# EAGLE design YF-Buzzer (EAGLE 9.5.2)
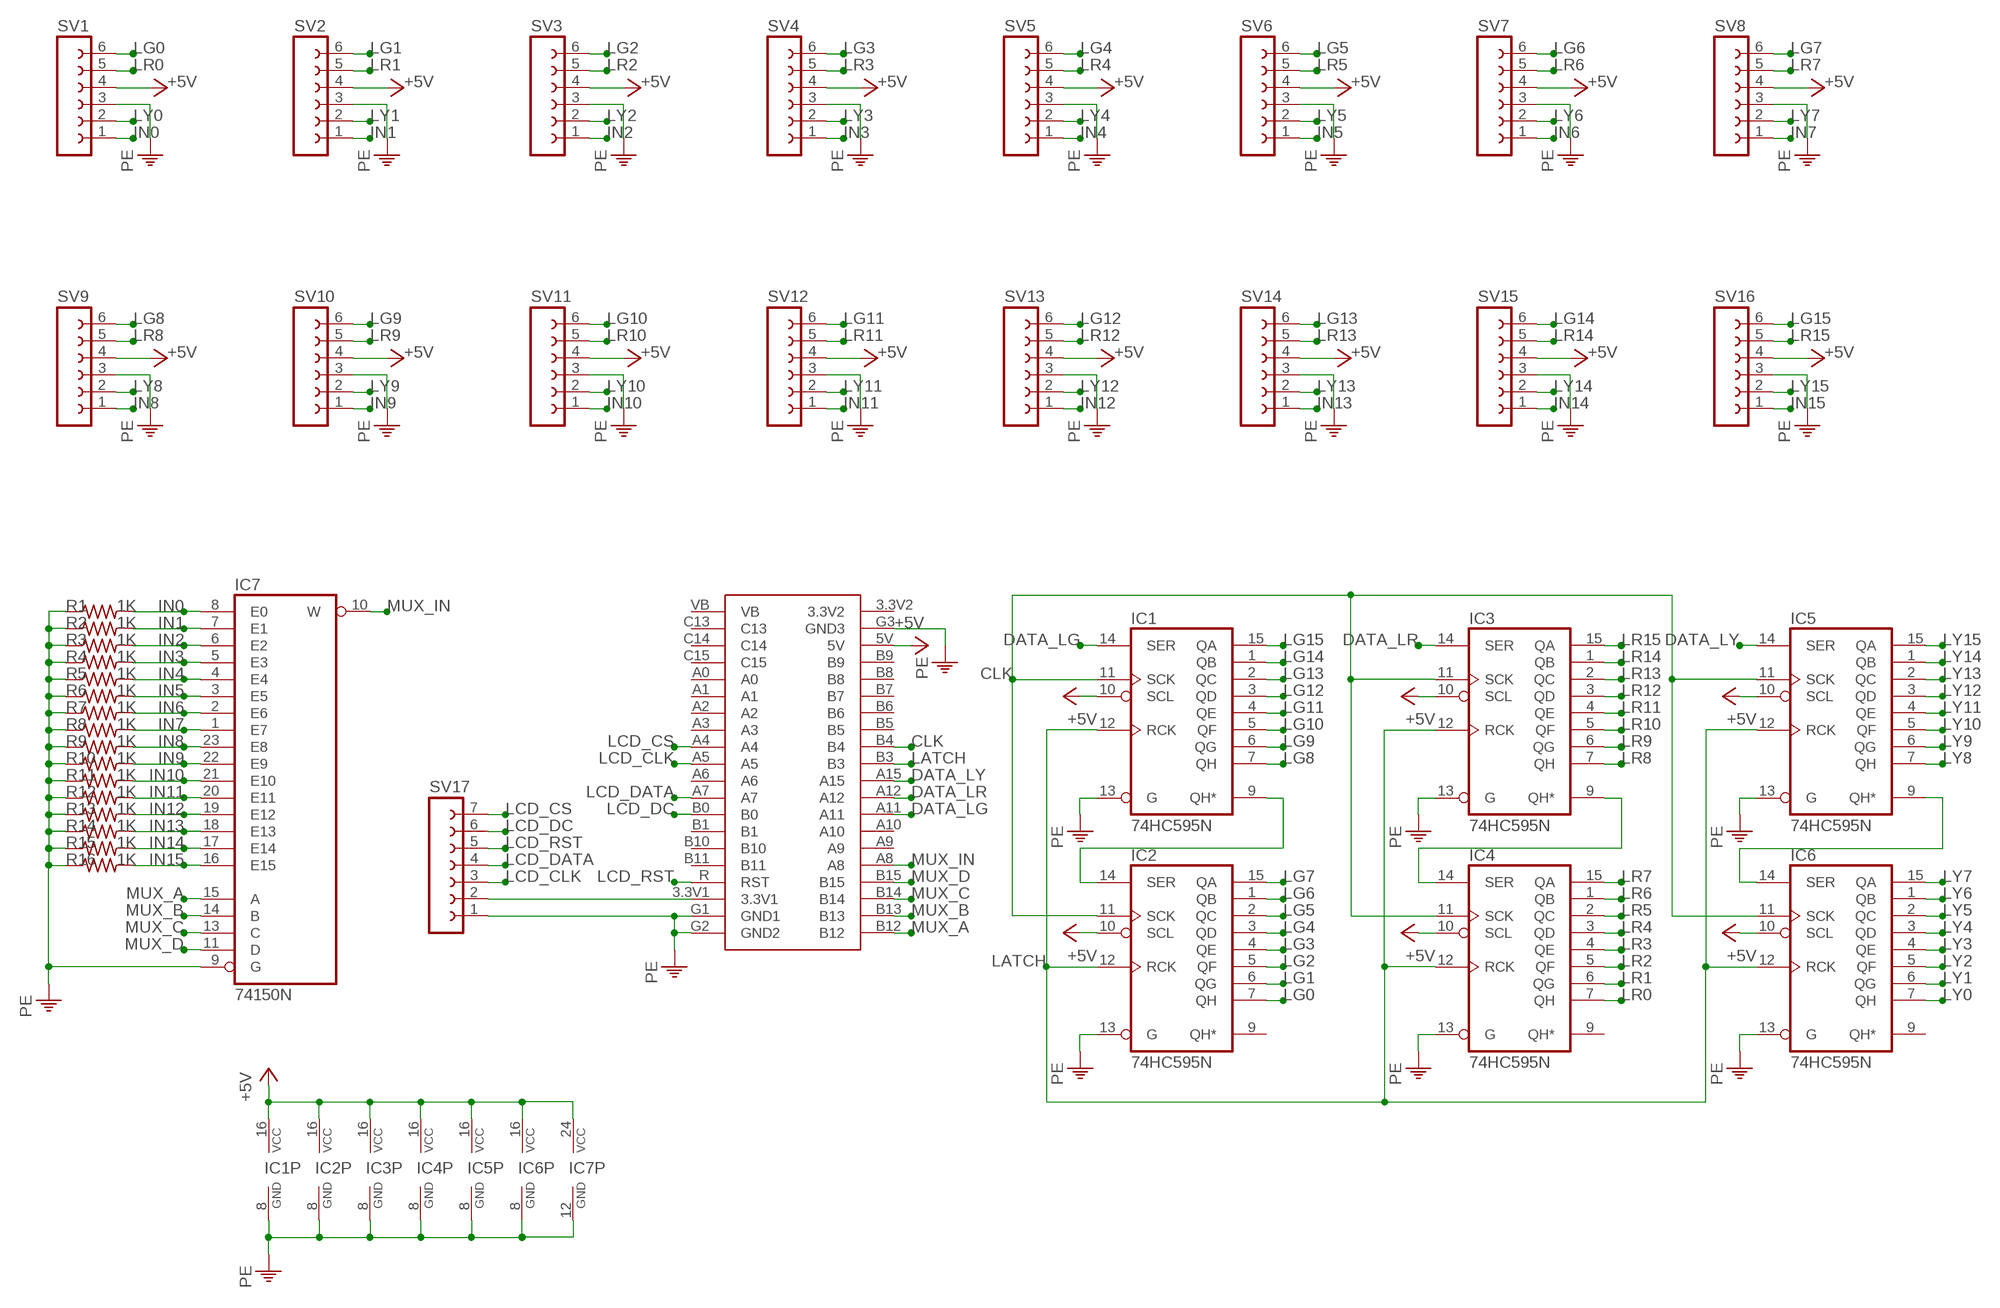
[diagram p0: schematic, sheet 1]

## Parts
IC1  74HC595N  [DIL16]
IC2  74HC595N  [DIL16]
IC3  74HC595N  [DIL16]
IC4  74HC595N  [DIL16]
IC5  74HC595N  [DIL16]
IC6  74HC595N  [DIL16]
IC7  74150N  [DIL24-6]
MCU1  STM32-BLUE  [STM32-BLUE]
R1  1K  R-US_0207/10  [0207/10]
R2  1K  R-US_0207/10  [0207/10]
R3  1K  R-US_0207/10  [0207/10]
R4  1K  R-US_0207/10  [0207/10]
R5  1K  R-US_0207/10  [0207/10]
R6  1K  R-US_0207/10  [0207/10]
R7  1K  R-US_0207/10  [0207/10]
R8  1K  R-US_0207/10  [0207/10]
R9  1K  R-US_0207/10  [0207/10]
R10  1K  R-US_0207/10  [0207/10]
R11  1K  R-US_0207/10  [0207/10]
R12  1K  R-US_0207/10  [0207/10]
R13  1K  R-US_0207/10  [0207/10]
R14  1K  R-US_0207/10  [0207/10]
R15  1K  R-US_0207/10  [0207/10]
R16  1K  R-US_0207/10  [0207/10]
SV1  FE06-1  [FE06]
SV2  FE06-1  [FE06]
SV3  FE06-1  [FE06]
SV4  FE06-1  [FE06]
SV5  FE06-1  [FE06]
SV6  FE06-1  [FE06]
SV7  FE06-1  [FE06]
SV8  FE06-1  [FE06]
SV9  FE06-1  [FE06]
SV10  FE06-1  [FE06]
SV11  FE06-1  [FE06]
SV12  FE06-1  [FE06]
SV13  FE06-1  [FE06]
SV14  FE06-1  [FE06]
SV15  FE06-1  [FE06]
SV16  FE06-1  [FE06]
SV17  FE07-1  [FE07]

## Nets
+5V: IC1.10(SCL) IC1.16(VCC) IC2.10(SCL) IC2.16(VCC) IC3.10(SCL) IC3.16(VCC) IC4.10(SCL) IC4.16(VCC) IC5.10(SCL) IC5.16(VCC) IC6.10(SCL) IC6.16(VCC) IC7.24(VCC) MCU1.5V SV1.4 SV2.4 SV3.4 SV4.4 SV5.4 SV6.4 SV7.4 SV8.4 SV9.4 SV10.4 SV11.4 SV12.4 SV13.4 SV14.4 SV15.4 SV16.4
CLK: IC1.11(SCK) IC2.11(SCK) IC3.11(SCK) IC4.11(SCK) IC5.11(SCK) IC6.11(SCK) MCU1.B4
DATA_LG: IC1.14(SER) MCU1.A11
DATA_LR: IC3.14(SER) MCU1.A12
DATA_LY: IC5.14(SER) MCU1.A15
IN0: IC7.8(E0) R1.2 SV1.1
IN1: IC7.7(E1) R2.2 SV2.1
IN2: IC7.6(E2) R3.2 SV3.1
IN3: IC7.5(E3) R4.2 SV4.1
IN4: IC7.4(E4) R5.2 SV5.1
IN5: IC7.3(E5) R6.2 SV6.1
IN6: IC7.2(E6) R7.2 SV7.1
IN7: IC7.1(E7) R8.2 SV8.1
IN8: IC7.23(E8) R9.2 SV9.1
IN9: IC7.22(E9) R10.2 SV10.1
IN10: IC7.21(E10) R11.2 SV11.1
IN11: IC7.20(E11) R12.2 SV12.1
IN12: IC7.19(E12) R13.2 SV13.1
IN13: IC7.18(E13) R14.2 SV14.1
IN14: IC7.17(E14) R15.2 SV15.1
IN15: IC7.16(E15) R16.2 SV16.1
LATCH: IC1.12(RCK) IC2.12(RCK) IC3.12(RCK) IC4.12(RCK) IC5.12(RCK) IC6.12(RCK) MCU1.B3
LCD_CLK: MCU1.A5 SV17.3
LCD_CS: MCU1.A4 SV17.7
LCD_DATA: MCU1.A7 SV17.4
LCD_DC: MCU1.B0 SV17.6
LCD_RST: MCU1.R(RST) SV17.5
LG0: IC2.7(QH) SV1.6
LG1: IC2.6(QG) SV2.6
LG2: IC2.5(QF) SV3.6
LG3: IC2.4(QE) SV4.6
LG4: IC2.3(QD) SV5.6
LG5: IC2.2(QC) SV6.6
LG6: IC2.1(QB) SV7.6
LG7: IC2.15(QA) SV8.6
LG8: IC1.7(QH) SV9.6
LG9: IC1.6(QG) SV10.6
LG10: IC1.5(QF) SV11.6
LG11: IC1.4(QE) SV12.6
LG12: IC1.3(QD) SV13.6
LG13: IC1.2(QC) SV14.6
LG14: IC1.1(QB) SV15.6
LG15: IC1.15(QA) SV16.6
LR0: IC4.7(QH) SV1.5
LR1: IC4.6(QG) SV2.5
LR2: IC4.5(QF) SV3.5
LR3: IC4.4(QE) SV4.5
LR4: IC4.3(QD) SV5.5
LR5: IC4.2(QC) SV6.5
LR6: IC4.1(QB) SV7.5
LR7: IC4.15(QA) SV8.5
LR8: IC3.7(QH) SV9.5
LR9: IC3.6(QG) SV10.5
LR10: IC3.5(QF) SV11.5
LR11: IC3.4(QE) SV12.5
LR12: IC3.3(QD) SV13.5
LR13: IC3.2(QC) SV14.5
LR14: IC3.1(QB) SV15.5
LR15: IC3.15(QA) SV16.5
LY0: IC6.7(QH) SV1.2
LY1: IC6.6(QG) SV2.2
LY2: IC6.5(QF) SV3.2
LY3: IC6.4(QE) SV4.2
LY4: IC6.3(QD) SV5.2
LY5: IC6.2(QC) SV6.2
LY6: IC6.1(QB) SV7.2
LY7: IC6.15(QA) SV8.2
LY8: IC5.7(QH) SV9.2
LY9: IC5.6(QG) SV10.2
LY10: IC5.5(QF) SV11.2
LY11: IC5.4(QE) SV12.2
LY12: IC5.3(QD) SV13.2
LY13: IC5.2(QC) SV14.2
LY14: IC5.1(QB) SV15.2
LY15: IC5.15(QA) SV16.2
MUX_A: IC7.15(A) MCU1.B12
MUX_B: IC7.14(B) MCU1.B13
MUX_C: IC7.13(C) MCU1.B14
MUX_D: IC7.11(D) MCU1.B15
MUX_IN: IC7.10(W) MCU1.A8
N$1: IC1.9(QH*) IC2.14(SER)
N$2: IC3.9(QH*) IC4.14(SER)
N$3: IC5.9(QH*) IC6.14(SER)
N$36: MCU1.3.3V1 SV17.2
PE: IC1.8(GND) IC1.13(G) IC2.8(GND) IC2.13(G) IC3.8(GND) IC3.13(G) IC4.8(GND) IC4.13(G) IC5.8(GND) IC5.13(G) IC6.8(GND) IC6.13(G) IC7.9(G) IC7.12(GND) MCU1.G1(GND1) MCU1.G2(GND2) MCU1.G3(GND3) R1.1 R2.1 R3.1 R4.1 R5.1 R6.1 R7.1 R8.1 R9.1 R10.1 R11.1 R12.1 R13.1 R14.1 R15.1 R16.1 SV1.3 SV2.3 SV3.3 SV4.3 SV5.3 SV6.3 SV7.3 SV8.3 SV9.3 SV10.3 SV11.3 SV12.3 SV13.3 SV14.3 SV15.3 SV16.3 SV17.1
Unconnected: IC2.9(QH*) IC4.9(QH*) IC6.9(QH*) MCU1.A0 MCU1.A1 MCU1.A2 MCU1.A3 MCU1.A6 MCU1.A9 MCU1.A10 MCU1.B1 MCU1.B5 MCU1.B6 MCU1.B7 MCU1.B8 MCU1.B9 MCU1.B10 MCU1.B11 MCU1.C13 MCU1.C14 MCU1.C15

## Power pins joined to a net without a drawn wire
3.3V2: MCU1.3.3V2
VB: MCU1.VB

## Library data of the parts
IC1-IC6 = 74xx-eu:74*595: 8-bit SHIFT REGISTER, output latch
IC7 = 74xx-eu:74*150: Data SELCTOR/MULTIPLEXER
MCU1 = Jonathan:STM32-BLUE: STM32 Blue Pill <https://wiki.stm32duino.com/index.php?title=Blue_Pill> Designed for the STM32F103 microcontroller board. V1.0 by Jonathan Ho May 2019
R1-R16 = rcl:R-US_: RESISTOR, American symbol; SPICEPREFIX: R
SV1-SV16 = con-lsta:FE06-1: FEMALE HEADER; OC_FARNELL: unknown; OC_NEWARK: unknown
SV17 = con-lsta:FE07-1: FEMALE HEADER; OC_FARNELL: unknown; OC_NEWARK: unknown

## Board
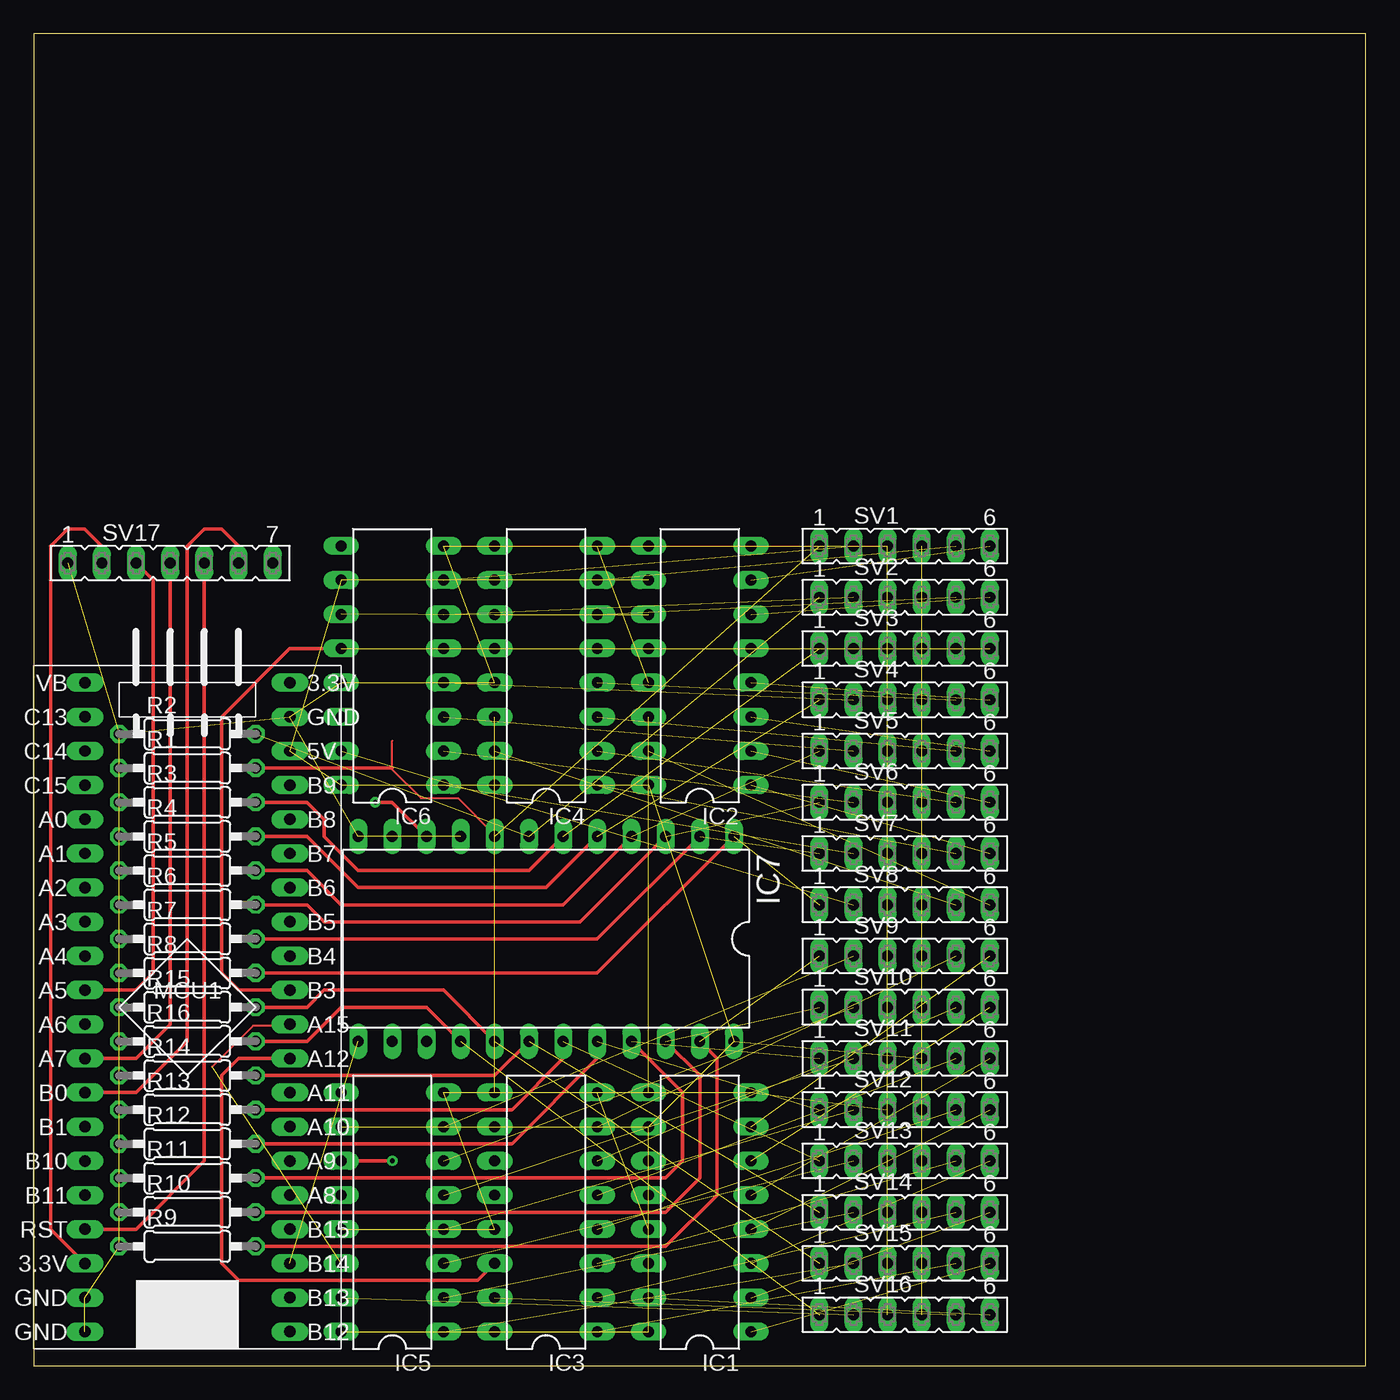
[diagram p1: board, top side]
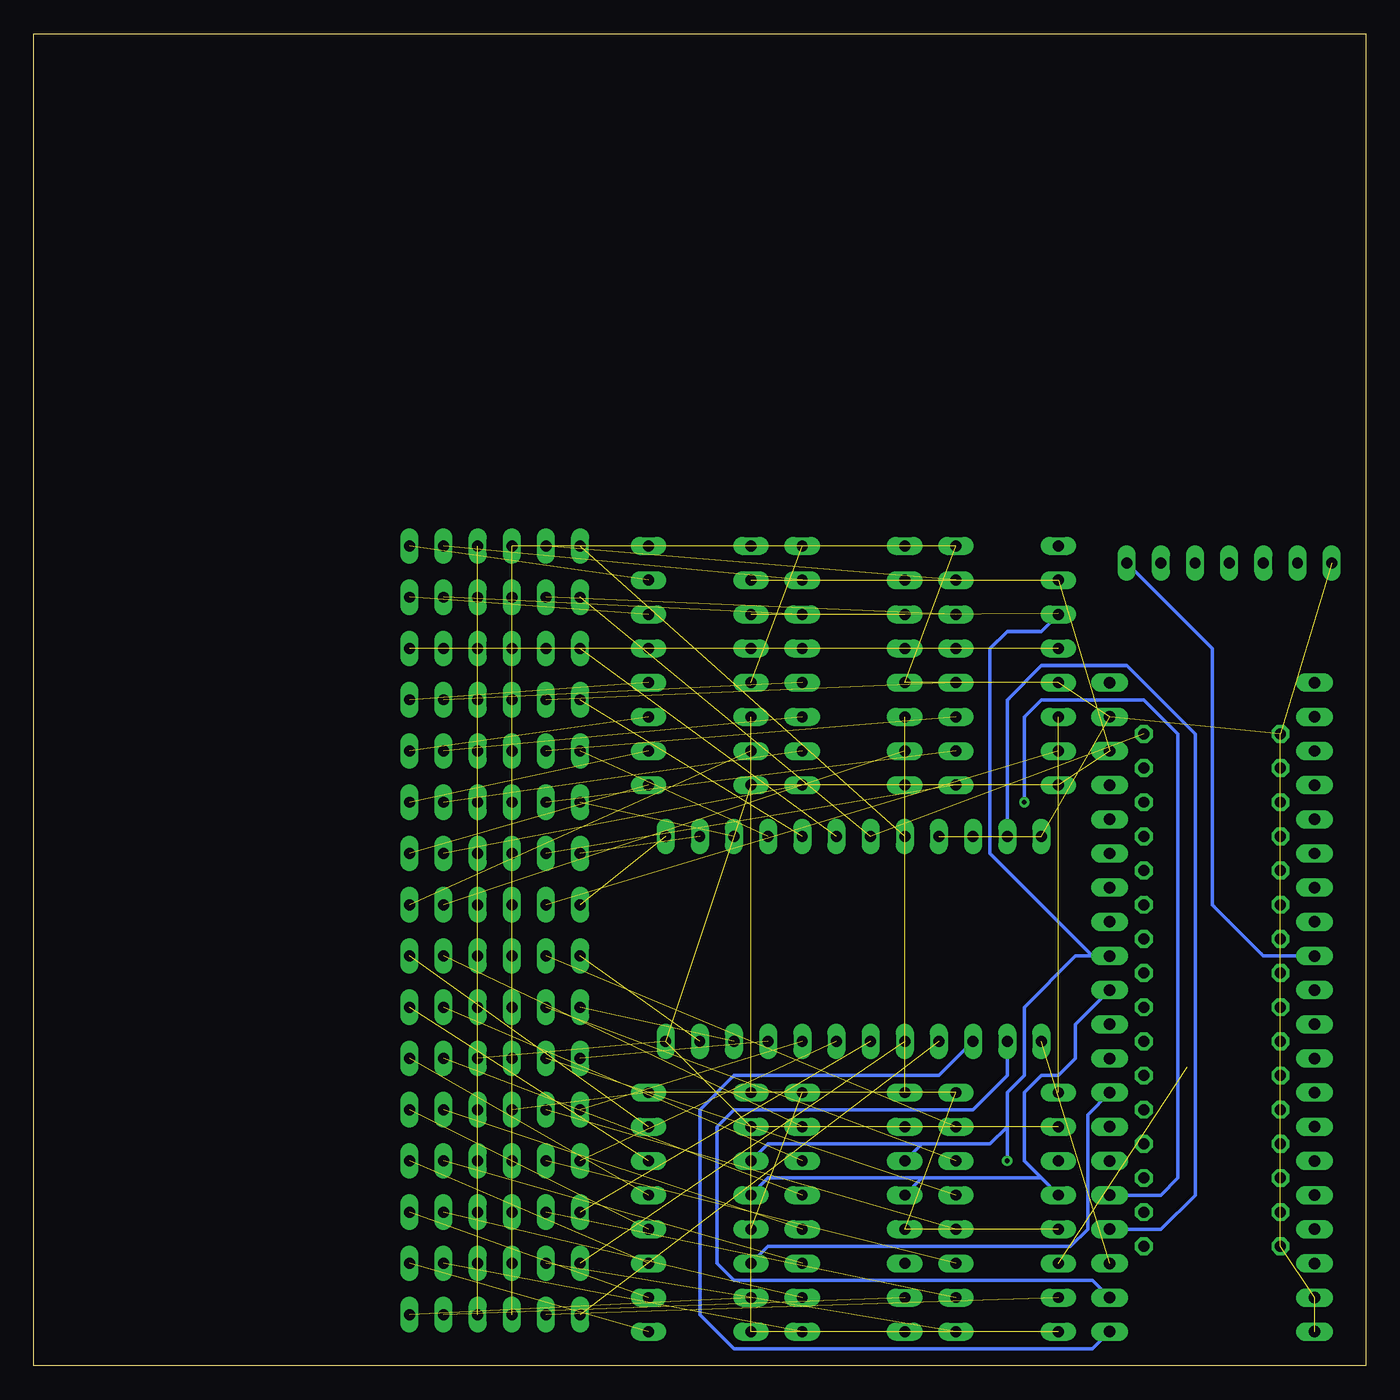
[diagram p2: board, bottom side, seen from below]

Size 99.06 x 99.06 mm. Coordinates in mm from the lower left corner, seen from the top.
Outline: 0,0 99.06,0 99.06,99.06 0,99.06 0,0
Copper layers (1*16): Top 0.035mm / dielectric 1.5mm / Bottom 0.035mm
Design rules "default": minimum track width 6mil, minimum drill 0.35mm, track to track 6mil, track to pad 6mil, pad to pad 6mil, via to via 6mil, smd to smd 6mil, copper to edge 40mil, drill to drill 6mil, minimum pad ring 10mil, minimum via ring 8mil, stop-mask expansion 4mil, vias tented up to drill 0mil, thermal gap 10mil

### Footprints (pad centres in the part's own frame; a part is rotated, then mirrored left to right if it is on the bottom)
DIL16 = drill 0.813 long: 1 -8.89,-3.81; 2 -6.35,-3.81; 3 -3.81,-3.81; 4 -1.27,-3.81; 5 1.27,-3.81; 6 3.81,-3.81; 7 6.35,-3.81; 8 8.89,-3.81; 9 8.89,3.81; 10 6.35,3.81; 11 3.81,3.81; 12 1.27,3.81; 13 -1.27,3.81; 14 -3.81,3.81; 15 -6.35,3.81; 16 -8.89,3.81
DIL24-6 = drill 0.813 long: 1 -13.97,-7.62; 2 -11.43,-7.62; 3 -8.89,-7.62; 4 -6.35,-7.62; 5 -3.81,-7.62; 6 -1.27,-7.62; 7 1.27,-7.62; 8 3.81,-7.62; 9 6.35,-7.62; 10 8.89,-7.62; 11 11.43,-7.62; 12 13.97,-7.62; 13 13.97,7.62; 14 11.43,7.62; 15 8.89,7.62; 16 6.35,7.62; 17 3.81,7.62; 18 1.27,7.62; 19 -1.27,7.62; 20 -3.81,7.62; 21 -6.35,7.62; 22 -8.89,7.62; 23 -11.43,7.62; 24 -13.97,7.62
STM32-BLUE = drill 0.85 long: 3.3V1 -7.62,-19.05; 3.3V2 7.62,24.13; 5V 7.62,19.05; A0 -7.62,13.97; A1 -7.62,11.43; A2 -7.62,8.89; A3 -7.62,6.35; A4 -7.62,3.81; A5 -7.62,1.27; A6 -7.62,-1.27; A7 -7.62,-3.81; A8 7.62,-13.97; A9 7.62,-11.43; A10 7.62,-8.89; A11 7.62,-6.35; A12 7.62,-3.81; A15 7.62,-1.27; B0 -7.62,-6.35; B1 -7.62,-8.89; B3 7.62,1.27; B4 7.62,3.81; B5 7.62,6.35; B6 7.62,8.89; B7 7.62,11.43; B8 7.62,13.97; B9 7.62,16.51; B10 -7.62,-11.43; B11 -7.62,-13.97; B12 7.62,-24.13; B13 7.62,-21.59; B14 7.62,-19.05; B15 7.62,-16.51; C13 -7.62,21.59; C14 -7.62,19.05; C15 -7.62,16.51; G1 -7.62,-21.59; G2 -7.62,-24.13; G3 7.62,21.59; R -7.62,-16.51; VB -7.62,24.13
0207/10 = drill 0.813 octagon: 1 -5.08,0; 2 5.08,0
FE06 = drill 0.813 long: 1 -6.35,0; 2 -3.81,0; 3 -1.27,0; 4 1.27,0; 5 3.81,0; 6 6.35,0
FE07 = drill 0.813 long: 1 -7.62,0; 2 -5.08,0; 3 -2.54,0; 4 0,0; 5 2.54,0; 6 5.08,0; 7 7.62,0

### Placement (x,y rotation side)
IC1  49.53,11.43 90 top
IC2  49.53,52.07 90 top
IC3  38.1,11.43 90 top
IC4  38.1,52.07 90 top
IC5  26.67,11.43 90 top
IC6  26.67,52.07 90 top
IC7  38.1,31.75 180 top
MCU1  11.43,26.67 0 top
R1  11.43,44.45 0 top
R2  11.43,46.99 0 top
R3  11.43,41.91 0 top
R4  11.43,39.37 0 top
R5  11.43,36.83 0 top
R6  11.43,34.29 0 top
R7  11.43,31.75 0 top
R8  11.43,29.21 0 top
R9  11.43,8.89 0 top
R10  11.43,11.43 0 top
R11  11.43,13.97 0 top
R12  11.43,16.51 0 top
R13  11.43,19.05 0 top
R14  11.43,21.59 0 top
R15  11.43,26.67 0 top
R16  11.43,24.13 0 top
SV1  64.77,60.96 0 top
SV2  64.77,57.15 0 top
SV3  64.77,53.34 0 top
SV4  64.77,49.53 0 top
SV5  64.77,45.72 0 top
SV6  64.77,41.91 0 top
SV7  64.77,38.1 0 top
SV8  64.77,34.29 0 top
SV9  64.77,30.48 0 top
SV10  64.77,26.67 0 top
SV11  64.77,22.86 0 top
SV12  64.77,19.05 0 top
SV13  64.77,15.24 0 top
SV14  64.77,11.43 0 top
SV15  64.77,7.62 0 top
SV16  64.77,3.81 0 top
SV17  10.16,59.69 0 top

### Tracks (layer width: path | path; a pad name or v marks a point on that pad's centre or on a via)
+5V  (29 unrouted)
CLK  (via drill 0.35)  (2 unrouted)
  Top 0.152: 22.86,55.93 IC6.11
  Top 0.254: v26.67,15.24 IC5.11
  Bottom 0.254: IC6.11 24.13,54.61 26.67,54.61 27.94,53.34 27.94,38.1 20.32,30.48 MCU1.B4 21.59,30.48 25.4,26.67 25.4,21.59 26.67,20.32 26.67,17.78 | 26.67,17.78 v26.67,15.24 | 26.67,17.78 27.94,16.51 33.02,16.51 | 33.02,16.51 IC3.11 | IC1.11 44.45,16.51 33.02,16.51
DATA_LG
  Bottom 0.254: MCU1.A11 20.69,18.68 20.69,10.16 21.96,8.89 44.45,8.89 IC1.14
DATA_LR
  Top 0.254: IC3.14 33.02,6.35 15.24,6.35 13.97,7.62 13.97,21.59 15.24,22.86 MCU1.A12
DATA_LY  (1 unrouted)
  Top 0.152: 13.26,22.25 16.31,25.3 19.05,25.3 MCU1.A15
IN0  (1 unrouted)
  Top 0.152: IC7.8 34.29,39.47 31.55,42.22 28.8,42.22 26.67,44.35 26.67,44.45 26.67,46.48
  Top 0.254: R1.2 26.67,44.45
IN1  (2 unrouted)
IN2  (1 unrouted)
  Top 0.254: R3.2 20.32,41.91 21.59,40.64 21.59,39.37 24.13,36.83 36.83,36.83 IC7.6
IN3  (1 unrouted)
  Top 0.254: R4.2 20.32,39.37 24.13,35.56 38.1,35.56 IC7.5
IN4  (1 unrouted)
  Top 0.254: R5.2 20.32,36.83 22.86,34.29 39.37,34.29 IC7.4
IN5  (1 unrouted)
  Top 0.254: R6.2 20.32,34.29 21.59,33.02 40.64,33.02 IC7.3
IN6  (1 unrouted)
  Top 0.254: R7.2 41.91,31.75 IC7.2
IN7  (1 unrouted)
  Top 0.254: IC7.1 41.91,29.21 R8.2
IN8  (1 unrouted)
  Top 0.254: IC7.23 50.8,22.86 50.8,12.7 46.99,8.89 R9.2
IN9  (1 unrouted)
  Top 0.254: IC7.22 49.53,21.59 49.53,13.97 46.99,11.43 R10.2
IN10  (1 unrouted)
  Top 0.254: IC7.21 48.26,20.32 48.26,15.24 46.99,13.97 R11.2
IN11  (1 unrouted)
  Top 0.254: IC7.20 41.91,22.86 35.56,16.51 R12.2
IN12  (1 unrouted)
  Top 0.254: IC7.19 39.37,22.86 35.56,19.05 R13.2
IN13  (1 unrouted)
  Top 0.254: IC7.18 34.29,21.59 R14.2
IN14  (1 unrouted)
  Top 0.254: R15.2 20.32,26.67 21.59,27.94 30.48,27.94 IC7.17
IN15  (1 unrouted)
  Top 0.254: R16.2 20.32,24.13 22.86,26.67 29.21,26.67 IC7.16
LATCH  (2 unrouted)
  Top 0.254: MCU1.B3 15.24,27.94 13.97,29.21 13.97,48.26 19.05,53.34 IC6.12
  Bottom 0.254: 24.13,13.97 IC5.12 | IC1.12 44.45,13.97 33.02,13.97 | 33.02,13.97 24.13,13.97 | IC3.12 33.02,13.97 | 24.13,13.97 25.4,15.24 25.4,20.32 24.13,21.59 22.86,21.59 21.59,22.86 21.59,25.4 MCU1.B3
LCD_CLK
  Top 0.254: MCU1.A5 7.62,27.94 8.89,29.21 8.89,58.42 SV17.3
LCD_CS
  Bottom 0.254: MCU1.A4 7.62,30.48 11.43,34.29 11.43,53.34 SV17.7
LCD_DATA
  Top 0.254: MCU1.A7 7.62,22.86 10.16,25.4 SV17.4
LCD_DC
  Top 0.254: MCU1.B0 7.62,20.32 11.43,24.13 11.43,60.96 12.7,62.23 13.97,62.23 15.24,60.96 SV17.6
LCD_RST
  Top 0.254: MCU1.R 7.62,10.16 12.7,15.24 SV17.5
LG0  (1 unrouted)
LG1  (1 unrouted)
LG2  (1 unrouted)
LG3  (1 unrouted)
LG4  (1 unrouted)
LG5  (1 unrouted)
LG6  (1 unrouted)
LG7  (1 unrouted)
LG8  (1 unrouted)
LG9  (1 unrouted)
LG10  (1 unrouted)
LG11  (1 unrouted)
LG12  (1 unrouted)
LG13  (1 unrouted)
LG14  (1 unrouted)
LG15  (1 unrouted)
LR0  (1 unrouted)
LR1  (1 unrouted)
LR2  (1 unrouted)
LR3  (1 unrouted)
LR4  (1 unrouted)
LR5  (1 unrouted)
LR6  (1 unrouted)
LR7  (1 unrouted)
LR8  (1 unrouted)
LR9  (1 unrouted)
LR10  (1 unrouted)
  Bottom 0.152: 41.91,12.65 IC3.5
LR11  (1 unrouted)
LR12  (1 unrouted)
LR13  (1 unrouted)
LR14  (1 unrouted)
LR15  (1 unrouted)
LY0  (1 unrouted)
LY1  (1 unrouted)
LY2  (1 unrouted)
LY3  (1 unrouted)
LY4  (1 unrouted)
LY5  (1 unrouted)
LY6  (1 unrouted)
LY7  (1 unrouted)
LY8  (1 unrouted)
LY9  (1 unrouted)
LY10  (1 unrouted)
LY11  (1 unrouted)
LY12  (1 unrouted)
LY13  (1 unrouted)
LY14  (1 unrouted)
LY15  (1 unrouted)
MUX_A
  Bottom 0.254: IC7.15 31.75,21.59 46.99,21.59 49.53,19.05 49.53,3.81 46.99,1.27 20.32,1.27 MCU1.B12
MUX_B
  Bottom 0.254: IC7.14 26.67,21.59 29.21,19.05 46.99,19.05 48.26,17.78 48.26,7.62 46.99,6.35 20.32,6.35 MCU1.B13
MUX_C  (1 unrouted)
  Bottom 0.152: 24.23,24.08 IC7.13
MUX_D
  Bottom 0.254: MCU1.B15 15.24,10.16 12.7,12.7 12.7,46.99 17.78,52.07 24.13,52.07 26.67,49.53 IC7.11
MUX_IN  (via drill 0.35)
  Top 0.254: IC7.10 26.67,41.91 v25.4,41.91
  Bottom 0.254: MCU1.A8 15.24,12.7 13.97,13.97 13.97,46.99 16.51,49.53 24.13,49.53 25.4,48.26 v25.4,41.91
N$1  (1 unrouted)
N$2  (1 unrouted)
N$3  (1 unrouted)
N$36
  Top 0.254: MCU1.3.3V1 1.27,10.16 1.27,60.96 2.54,62.23 3.81,62.23 5.08,60.96 SV17.2
PE  (49 unrouted)